# Altium project ESP_Radio.PrjPcb
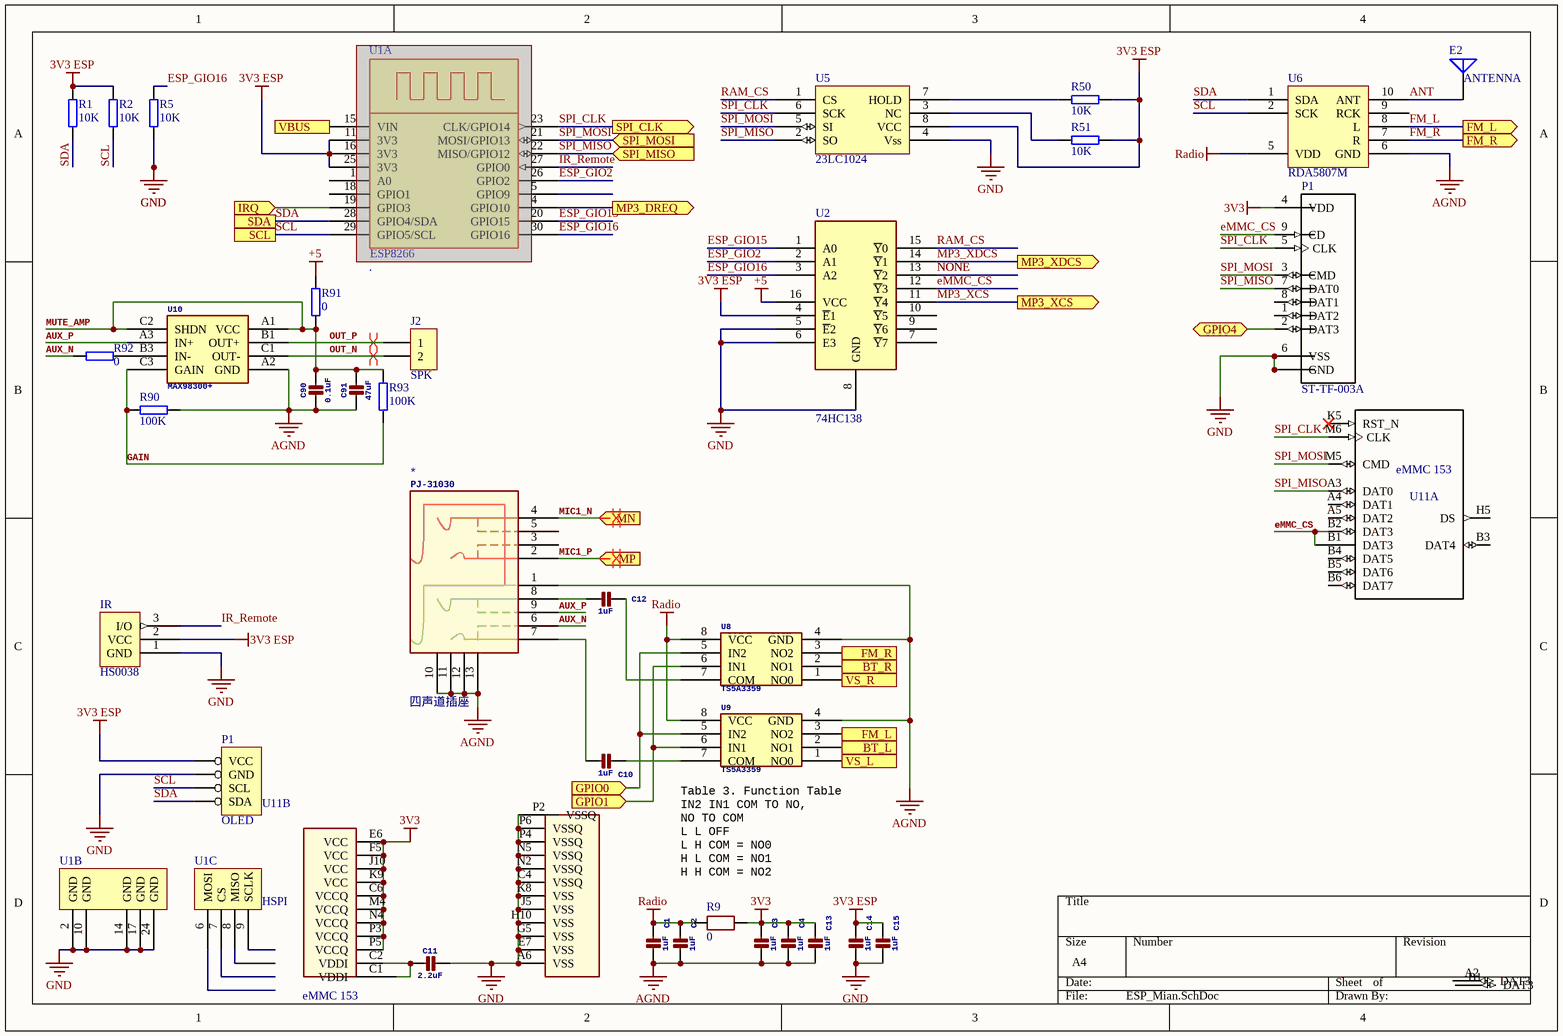
[diagram p0: ESP_Mian.SchDoc]
5 sheets, 201 parts. Net scope: flat (ports and power ports of the same name join across sheets).
Board file: Radio.PcbDoc
Sheets:
  ESP_Mian.SchDoc
  VS1053.SchDoc
  CSR8645.SchDoc
  PowerSys.SchDoc
  BQ24610.SchDoc

## Sheet ESP_Mian.SchDoc
size A4

### Parts
(Parts that share a designator on the sheet are numbered #1, #2 ... from top to bottom, then left to right.)
*  四声道插座  [pj-31030]
C1  1uF  [1206]
C2  1uF  [1206]
C3  1uF  [1206]
C4  1uF  [1206]
C10  1uF  [1206]
C11  2.2uF  [0603]
C12  1uF  [1206]
C13  1uF  [0603AC]
C14  1uF  [1206]
C15  1uF  [1206]
C90  0.1uF  [0201]
C91  47uF  [_0805MP]
E2  ANTENNA  [P125-B]
IR  HS0038  [SIP03]
J2  SPK  [SIP2_1]
P1#1  ST-TF-003A  [*SUNTECH_ST-TF-003A_ST-TF-003A(Primary)]
P1#2  OLED  [SIP4]
R1  10K  [0805]
R2  10K  [0805]
R5  10K  [0603]
R9  0  [0603AR]
R50  10K  [0603]
R51  10K  [0603]
R90  100K  [0201]
R91  0  [0603]
R92  0  [0402]
R93  100K  [0201]
U1  .  [NodeMCU DevKit v1.0 - Inside Labels]  (parts A,B,C of 3)
U2  74HC138  [TSSOP-16]
U5  23LC1024  [SO8NB]
U6  RDA5807M  [RDA5807M]
U8  TS5A3359  [DCU-8N]
U9  TS5A3359  [DCU-8N]
U10  MAX98300+  [WLP-9]
U11  eMMC 153  [BGA153N50P14X14_1300X1150X100N_EM08APGD3-BA000-2(Primary)]  (parts A,B of 2)

### Ports
BT_L (in), BT_R (in), FM_L (in), FM_L (out), FM_R (in), FM_R (out), GPIO0 (in), GPIO1 (in), GPIO4 (bidir), IRQ (in), MN (in), MP3_DREQ (out), MP3_XCS (out), MP3_XDCS (out), MP (in), SCL, SDA, SPI_CLK (out), SPI_MISO (in), SPI_MOSI (in), VBUS (out), VS_L (in), VS_R (in)

### Nets
3V3: C3.1 C4.1 C13.1 P1#1.4(VDD) R9.1 U11.C6(VCCQ) U11.E6(VCC) U11.F5(VCC) U11.J10(VCC) U11.K9(VCC) U11.M4(VCCQ) U11.N4(VCCQ) U11.P3(VCCQ) U11.P5(VCCQ)
3V3 ESP: C14.1 C15.1 IR.2(VCC) P1#2.3(VCC) R1.2 R2.2 R50.1 R51.1 U1.11(3V3) U1.16(3V3) U1.25(3V3) U2.4(~{E}1) U5.8(VCC)
+5: R91.2 U2.16(VCC)
AGND: *.1 *.10 *.11 *.12 *.13 C1.2 C2.2 C3.2 C4.2 C13.2 C90.2 C91.2 R90.2 U6.6(GND) U8.4(GND) U9.4(GND) U10.A2(GND)
GND: C11.1 C14.2 C15.2 IR.1(GND) P1#1.6(VSS) P1#1.G1(GND) P1#1.G2(GND) P1#1.G3(GND) P1#1.G4(GND) P1#2.4(GND) R5.1 U1.2(GND) U1.10(GND) U1.14(GND) U1.17(GND) U1.24(GND) U2.5(~{E}2) U2.6(E3) U2.8(GND) U5.4(Vss) U11.A6(VSS) U11.C4(VSSQ) U11.E7(VSS) U11.G5(VSS) U11.H10(VSS) U11.J5(VSS) U11.K8(VSS) U11.N2(VSSQ) U11.N5(VSSQ) U11.P2(VSSQ) U11.P4(VSSQ) U11.P6(VSSQ)
Radio: C1.1 C2.1 R9.2 U6.5(VDD) U8.8(VCC) U9.8(VCC)
ANT: E2.1(A) U6.10(ANT)
AUX_N: *.6 R92.2
AUX_P: *.9 U10.A3(IN+)
BT_L: U9.2(NO1) ; port BT_L
BT_R: U8.2(NO1) ; port BT_R
eMMC_CS: P1#1.9(CD) U2.12(~{Y}3) U11.B1(DAT3) U11.B2(DAT3)
ESP_GIO2: U1.26(GPIO2) U2.2(A1)
ESP_GIO15: U1.20(GPIO15) U2.1(A0)
ESP_GIO16: R5.2 U1.30(GPIO16) U2.3(A2)
FM_L: U6.8(L) U9.3(NO2) ; port FM_L
FM_R: U6.7(R) U8.3(NO2) ; port FM_R
GAIN: R90.1 R93.2 U10.C3(GAIN)
GPIO0: U8.5(IN2) U9.5(IN2) ; port GPIO0
GPIO1: U8.6(IN1) U9.6(IN1) ; port GPIO1
IR_Remote: IR.3(I/O) U1.27(GPIO0)
MIC1_N: *.4 ; port MN
MIC1_P: *.2 ; port MP
MP3_DREQ: U1.4(GPIO10) ; port MP3_DREQ
MP3_XCS: U2.11(~{Y}4) ; port MP3_XCS
MP3_XDCS: U2.14(~{Y}1) ; port MP3_XDCS
MUTE_AMP: C90.1 C91.1 R91.1 R93.1 U10.A1(VCC) U10.C2(SHDN)
NONE: U2.13(~{Y}2)
OUT_N: J2.1(2) U10.C1(OUT-)
OUT_P: J2.2(1) U10.B1(OUT+)
RAM_CS: U2.15(~{Y}0) U5.1(CS)
SCL: P1#2.2(SCL) R2.1 U1.29(GPIO5/SCL) U6.2(SCK) ; port SCL
SDA: P1#2.1(SDA) R1.1 U1.28(GPIO4/SDA) U6.1(SDA) ; port SDA
SPI_CLK: P1#1.5(CLK) U1.23(CLK/GPIO14) U5.6(SCK) U11.M6(CLK) ; port SPI_CLK
SPI_MISO: P1#1.7(DAT0) U1.22(MISO/GPIO12) U5.2(SO) U11.A3(DAT0) ; port SPI_MISO
SPI_MOSI: P1#1.3(CMD) U1.21(MOSI/GPIO13) U5.5(SI) U11.M5(CMD) ; port SPI_MOSI
VS_L: U9.1(NO0) ; port VS_L
VS_R: U8.1(NO0) ; port VS_R
Net*_7: *.7 C10.2
Net*_8: *.8 C12.2
NetC10_1: C10.1 U9.7(COM)
NetC11_2: C11.2 U11.C1(VDDI) U11.C2(VDDI)
NetC12_1: C12.1 U8.7(COM)
NetP1#1_2: P1#1.2(DAT3) ; port GPIO4
NetR50_2: R50.2 U5.7(HOLD)
NetR51_2: R51.2 U5.3(NC)
NetR92_1: R92.1 U10.B3(IN-)
NetU1_15: U1.15(VIN) ; port VBUS
NetU1_19: U1.19(GPIO3) ; port IRQ

Not connected (* = marked no-connect by the designer): * 3 5; P1#1 1(DAT2) 8(DAT1); U1 1(A0) 5(GPIO9) 6(MOSI) 7(CS) 8(MISO) 9(SCLK) 18(GPIO1); U2 7(~{Y}7) 9(~{Y}6) 10(~{Y}5); U6 9(RCK); U11 A2(DAT3) A4(DAT1) A5(DAT2) B3(DAT4) B4(DAT5) B5(DAT6) B6(DAT7) H5(DS) K5(RST_N)*

### Layout directives
differential pair; differential pair class Amplifier: OUT_P
differential pair: MIC1_N, MIC1_P, OUT_N

### Notes on the sheet
- (near U11) Table 3. Function Table
  IN2 IN1 COM TO NO,
  NO TO COM
  L L OFF
  L H COM = NO0
  H L COM = NO1
  H H COM = NO2
- (in symbol ESP8266_Devlop, part A) ESP8266
- (in symbol ESP8266_Devlop, part C) HSPI

### Library data of the parts
* = 四声道插座: PJ-31030
C1 C10-C12 C14 C90 C91 = CAP_CERAMIC_0805MP: Ceramic CapacitorsFor new designs, use the packages preceded by an '_' character since they are more reliable:The following footprints should be used on most boards:For extremely tight-pitch boards where space is at a premium, the following 'micro-pitch' footprints can be used (smaller pads, no silkscreen outline, etc.):; GateName_1: G$1; SymbolName_1: CAPACITOR; DeviceName: _0805MP; LibraryName: microbuilder; DeviceSetName: CAP_CERAMIC
C2-C4 C13 C15 = CAP: Ceramic CapacitorsFor new designs, use the packages preceded by an '_' character since they are more reliable:The following footprints should be used on most boards:For extremely tight-pitch boards where space is at a premium, the following 'micro-pitch' footprints can be used (smaller pads, no silkscreen outline, etc.):; GateName_1: G$1; DeviceName: 0603-NOOUTLINE; DeviceSetName: CAP_CERAMIC; SymbolName_1: CAPACITOR; LibraryName: microbuilder
E2 = ANTENNA: Generic Antenna
J2 = CON2: Connector
P1#1 = ST-TF-003A: Micro SD; MF: Suntech; Package: None; MP: ST-TF-003A; Price: None; Availability: Unavailable; SnapEDA_Link: https://www.snapeda.com/parts/ST-TF-003A/Suntech/view-part/?ref=snap; Value: *
P1#2 = 4 HEADER: 4 Pin Header
R1 R2 R5 R9 R50 R51 R90-R93 = RES2: Resistor
U1 = ESP8266_Devlop
U2 = 74HC138: 3-to-8 line decoder/demultiplexer; inverting
U10 = MAX98300+: Mono 2.6W ClassD Amp.
U11 = eMMC 153: eMMC BGA-153 1.5x13x1.0; MF: Delkin Devices; MP: EM08APGD3-BA000-2; Availability: Unavailable; Price: None; Package: None; SnapEDA_Link: https://www.snapeda.com/parts/EM08APGD3-BA000-2/Delkin%20Devices/view-part/?ref=snap; Value: *

## Sheet VS1053.SchDoc
size A3; Organization: Altium Limited; Address1: L3, 12a Rodborough Rd; Address2: Frenchs Forest; Address3: NSW; Address4: Australia 2086
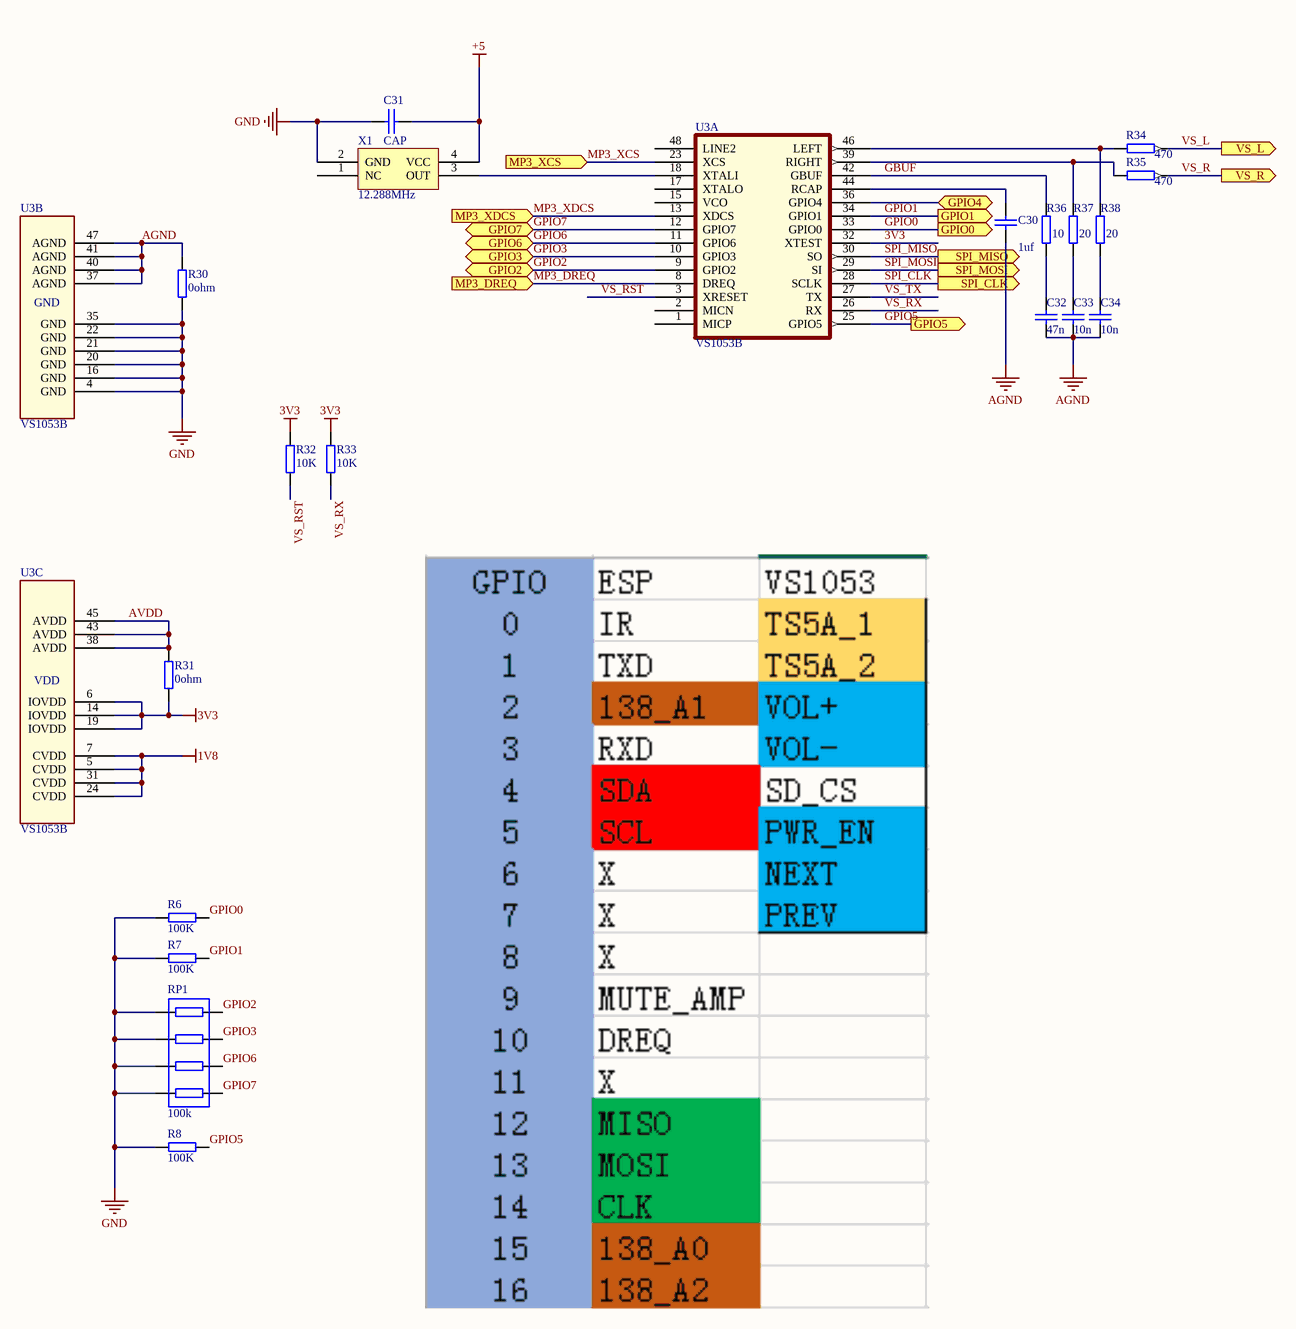
[diagram p1: VS1053.SchDoc]

### Parts
C30  value 1uf  [0402]  (hidden comment: Cap)
C31  CAP  [3528]
C32  value 47n  [0402]
C33  value 10n  [0402]  (hidden comment: Cap)
C34  value 10n  [0402]  (hidden comment: Cap)
R6  100K  [0603AR]
R7  100K  [0603AR]
R8  100K  [0603AR]
R30  0ohm  [0603AC]
R31  0ohm  [0603AC]
R32  10K  [0603AR]
R33  10K  [0603AR]
R34  470  [0603AR]
R35  470  [0603AR]
R36  10  [0603AC]
R37  20  [0603AC]
R38  20  [0603AC]
RP1  100k  [RN8]
U3  VS1053B  [LQFP-48]  (parts A,B,C of 3)
X1  12.288MHz  [DIL-14]

### Ports
GPIO0 (out), GPIO1 (out), GPIO2 (bidir), GPIO3 (bidir), GPIO4 (bidir), GPIO5 (out), GPIO6 (bidir), GPIO7 (bidir), MP3_DREQ (in), MP3_XCS (in), MP3_XDCS (in), SPI_CLK (out), SPI_MISO (out), SPI_MOSI (out), VS_L (out), VS_R (out)

### Nets
1V8: U3.5(CVDD) U3.7(CVDD) U3.24(CVDD) U3.31(CVDD)
3V3: R31.1 R32.2 R33.2 U3.6(IOVDD) U3.14(IOVDD) U3.19(IOVDD) U3.32(XTEST)
+5: C31.1 X1.4(VCC)
AGND: C30.1 C32.1 C33.1 C34.1 R30.2 U3.37(AGND) U3.40(AGND) U3.41(AGND) U3.47(AGND)
GND: C31.2 R6.1 R7.1 R8.1 R30.1 RP1.1 RP1.2 RP1.3 RP1.4 U3.4(GND) U3.16(GND) U3.20(GND) U3.21(GND) U3.22(GND) U3.35(GND) X1.2(GND)
AVDD: R31.2 U3.38(AVDD) U3.43(AVDD) U3.45(AVDD)
GBUF: R36.1 U3.42(GBUF)
GPIO0: R6.2 U3.33(GPIO0) ; port GPIO0
GPIO1: R7.2 U3.34(GPIO1) ; port GPIO1
GPIO2: RP1.8 U3.9(GPIO2) ; port GPIO2
GPIO3: RP1.7 U3.10(GPIO3) ; port GPIO3
GPIO5: R8.2 U3.25(GPIO5) ; port GPIO5
GPIO6: RP1.6 U3.11(GPIO6) ; port GPIO6
GPIO7: RP1.5 U3.12(GPIO7) ; port GPIO7
MP3_DREQ: U3.8(DREQ) ; port MP3_DREQ
MP3_XCS: U3.23(XCS) ; port MP3_XCS
MP3_XDCS: U3.13(XDCS) ; port MP3_XDCS
SPI_CLK: U3.28(SCLK) ; port SPI_CLK
SPI_MISO: U3.30(SO) ; port SPI_MISO
SPI_MOSI: U3.29(SI) ; port SPI_MOSI
VS_L: R34.2 ; port VS_L
VS_R: R35.2 ; port VS_R
VS_RST: R32.1 U3.3(XRESET)
VS_RX: R33.1 U3.26(RX)
VS_TX: U3.27(TX)
NetC30_2: C30.2 U3.44(RCAP)
NetC32_2: C32.2 R36.2
NetC33_2: C33.2 R37.2
NetC34_2: C34.2 R38.2
NetP1#1_2: U3.36(GPIO4) ; port GPIO4
NetR34_1: R34.1 R38.1 U3.46(LEFT)
NetR35_1: R35.1 R37.1 U3.39(RIGHT)
NetU3_18: U3.18(XTALI) X1.3(OUT)

Not connected (* = marked no-connect by the designer): U3 1(MICP) 2(MICN) 15(VCO) 17(XTALO) 48(LINE2); X1 1(NC)

### Notes on the sheet
- Title
- Size:
- Date:
- A3
- Number:
- Time:
- Revision:
- Sheet
- of
- File:
- (in symbol VS1053B, part C) VDD

### Library data of the parts
C30 C32-C34 = Cap: 贴片电容; Published: 8-Jun-2000; LatestRevisionDate: 17-Jul-2002; LatestRevisionNote: Re-released for DXP Platform.; PackageReference: RAD-0.3; Publisher: Altium Limited
C31 = CAP: Capacitor
R6-R8 R30-R38 = RES2: Resistor
RP1 = RESPACK4A: Resistor Network
X1 = OSC: 有源晶振

## Sheet CSR8645.SchDoc
size A3; Organization: Altium Limited; Address1: L3, 12a Rodborough Rd; Address2: Frenchs Forest; Address3: NSW; Address4: Australia 2086
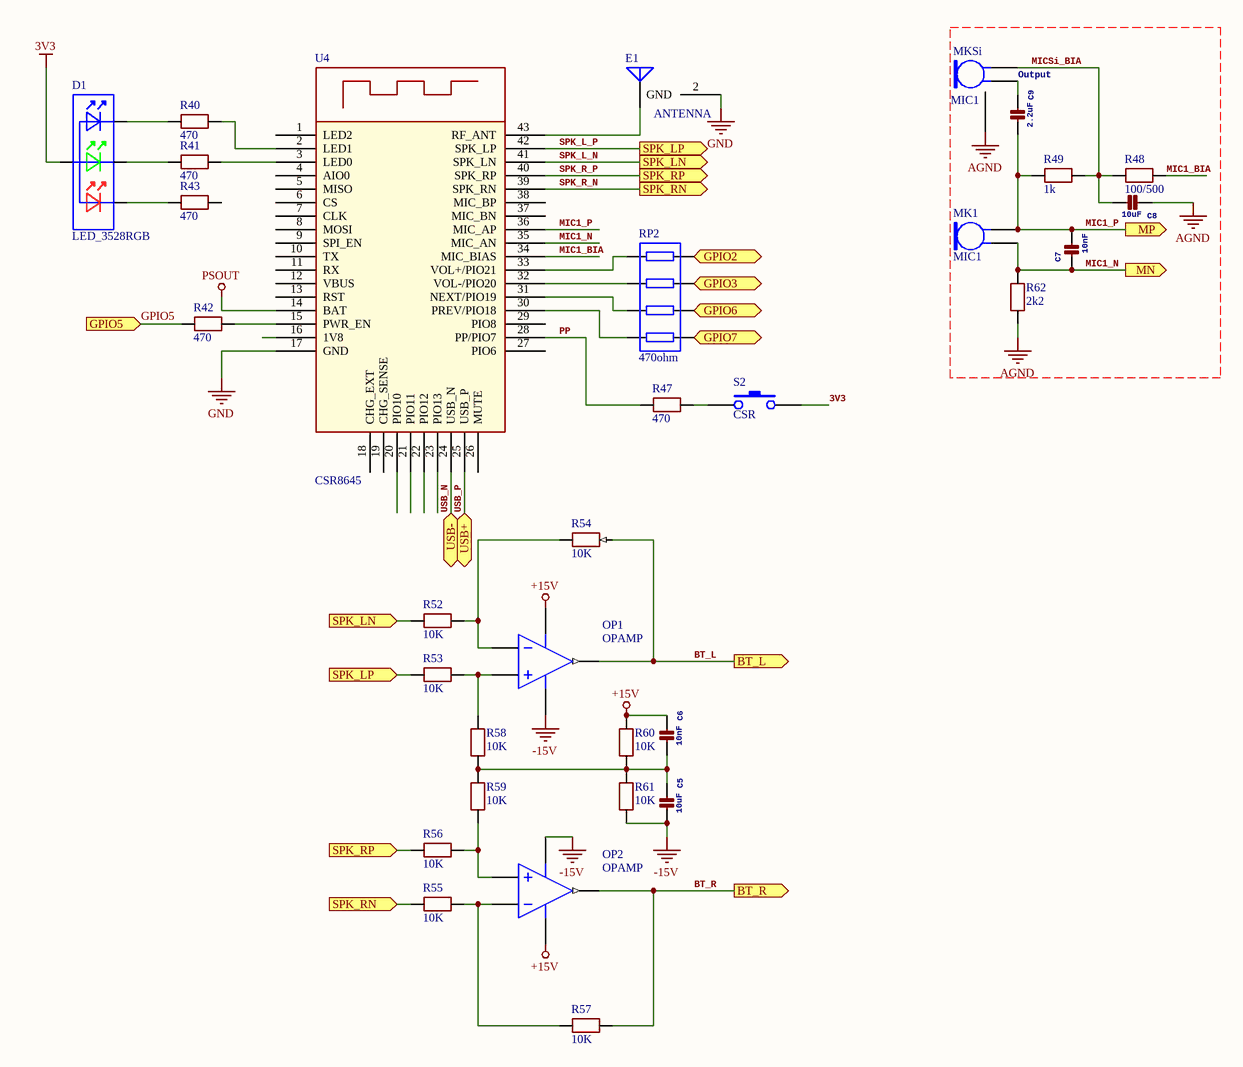
[diagram p2: CSR8645.SchDoc]

### Parts
C5  10uF  [RB3/7MM]
C6  10nF  [WIMA-MKS2C031001A00]
C7  10nF  [0201]
C8  10uF  [0201]
C9  2.2uF  [0201]
D1  LED_3528RGB  [1204_RGB]
E1  ANTENNA  [SMA_FR]
MK1  MIC1  [LED-F3]
MKSi  MIC1  [ADMP504]
OP1  OPAMP  [DIP-8]
OP2  OPAMP  [DIP-8]
R40  470  [0603AR]
R41  470  [0603AR]
R42  470  [0603AR]
R43  470  [0603AR]
R47  470  [0603AR]
R48  100/500  [0402]
R49  1k  [0402]
R52  10K  [MELF-R3216-1206]
R53  10K  [MELF-R3216-1206]
R54  10K  [MELF-R3216-1206]
R55  10K  [MELF-R3216-1206]
R56  10K  [MELF-R3216-1206]
R57  10K  [MELF-R3216-1206]
R58  10K  [MELF-R3216-1206]
R59  10K  [MELF-R3216-1206]
R60  10K  [MELF-R3216-1206]
R61  10K  [MELF-R3216-1206]
R62  2k2  [0402]
RP2  470ohm  [RN8]
S2  CSR  [sw_side]
U4  CSR8645  [CSR8645]

### Ports
BT_L (out), BT_R (out), GPIO2 (bidir), GPIO3 (bidir), GPIO5 (in), GPIO6 (bidir), GPIO7 (bidir), MN (out), MP (out), SPK_LN (in), SPK_LN (out), SPK_LP (in), SPK_LP (out), SPK_RN (in), SPK_RN (out), SPK_RP (in), SPK_RP (out), USB+ (bidir), USB- (bidir)

### Nets
3V3: D1.1(+) S2.1
+15V: C6.1 OP1.7(V+) OP2.7(V+) R60.1
-15V: C5.2 OP1.4(V-) OP2.4(V-) R61.2
AGND: C8.1 MKSi.2(GND) R62.2
GND: E1.2(GND) U4.17(GND)
PSOUT: U4.14(BAT)
BT_L: OP1.6(OUT) R54.1 ; port BT_L
BT_R: OP2.6(OUT) R57.1 ; port BT_R
GPIO2: RP2.8 ; port GPIO2
GPIO3: RP2.7 ; port GPIO3
GPIO5: R42.2 ; port GPIO5
GPIO6: RP2.6 ; port GPIO6
GPIO7: RP2.5 ; port GPIO7
MIC1_BIA: R48.2 U4.34(MIC_BIAS)
MIC1_N: C7.2 MK1.1 R62.1 U4.35(MIC_AN) ; port MN
MIC1_P: C7.1 C9.2 MK1.2 R49.2 U4.36(MIC_AP) ; port MP
MICSi_BIA: C8.2 MKSi.3(VDD) R48.1 R49.1
PP: R47.2 U4.28(PP/PIO7)
SPK_L_N: R52.2 U4.41(SPK_LN) ; port SPK_LN
SPK_L_P: R53.2 U4.42(SPK_LP) ; port SPK_LP
SPK_R_N: R55.2 U4.39(SPK_RN) ; port SPK_RN
SPK_R_P: R56.2 U4.40(SPK_RP) ; port SPK_RP
USB_N: U4.24(USB_N) ; port USB-
USB_P: U4.25(USB_P) ; port USB+
NetC5_1: C5.1 C6.2 R58.2 R59.1 R60.2 R61.1
NetC9_1: C9.1 MKSi.1(OUTPUT)
NetD1_2: D1.2(R-) R43.2
NetD1_3: D1.3(G-) R41.2
NetD1_4: D1.4(B-) R40.2
NetE1_1: E1.1(A) U4.43(RF_ANT)
NetOP1_2: OP1.2(IN-) R52.1 R54.2
NetOP1_3: OP1.3(IN+) R53.1 R58.1
NetOP2_2: OP2.2(IN-) R55.1 R57.2
NetOP2_3: OP2.3(IN+) R56.1 R59.2
NetR40_1: R40.1 U4.2(LED1)
NetR41_1: R41.1 U4.3(LED0)
NetR42_1: R42.1 U4.15(PWR_EN)
NetR47_1: R47.1 S2.2
NetRP2_1: RP2.1 U4.33(VOL+/PIO21)
NetRP2_2: RP2.2 U4.32(VOL-/PIO20)
NetRP2_3: RP2.3 U4.31(NEXT/PIO19)
NetRP2_4: RP2.4 U4.30(PREV/PIO18)

Not connected (* = marked no-connect by the designer): R43 1; U4 1(LED2) 4(AIO0) 5(MISO) 6(CS) 7(CLK) 8(MOSI) 9(SPI_EN) 10(TX) 11(RX) 12(VBUS) 13(RST) 16(1V8) 18(CHG_EXT) 19(CHG_SENSE) 20(PIO10) 21(PIO11) 22(PIO12) 23(PIO13) 26(MUTE) 27(PIO6) 29(PIO8) 37(MIC_BN) 38(MIC_BP)

### Notes on the sheet
- Output
- Title
- Size:
- Date:
- A3
- Number:
- Time:
- Revision:
- Sheet
- of
- File:

### Library data of the parts
C5-C9 = CAP: as C2 on sheet ESP_Mian; SymbolName_1: CAPACITOR; LibraryName: microbuilder
D1 = LED_3528RGB: LED-3528RGB
E1 = ANTENNA: Generic Antenna
MK1 MKSi = MICROPHONE2: Microphone
OP1 OP2 = OPAMP: Operational Amplifier
R40-R43 R47-R49 R52-R62 = RES2: Resistor
RP2 = RESPACK4A: Resistor Network
S2 = SW-PB
U4 = CSR8645: Bluetooth Audio

## Sheet PowerSys.SchDoc
size A3; Organization: Altium Limited; Address1: L3, 12a Rodborough Rd; Address2: Frenchs Forest; Address3: NSW; Address4: Australia 2086
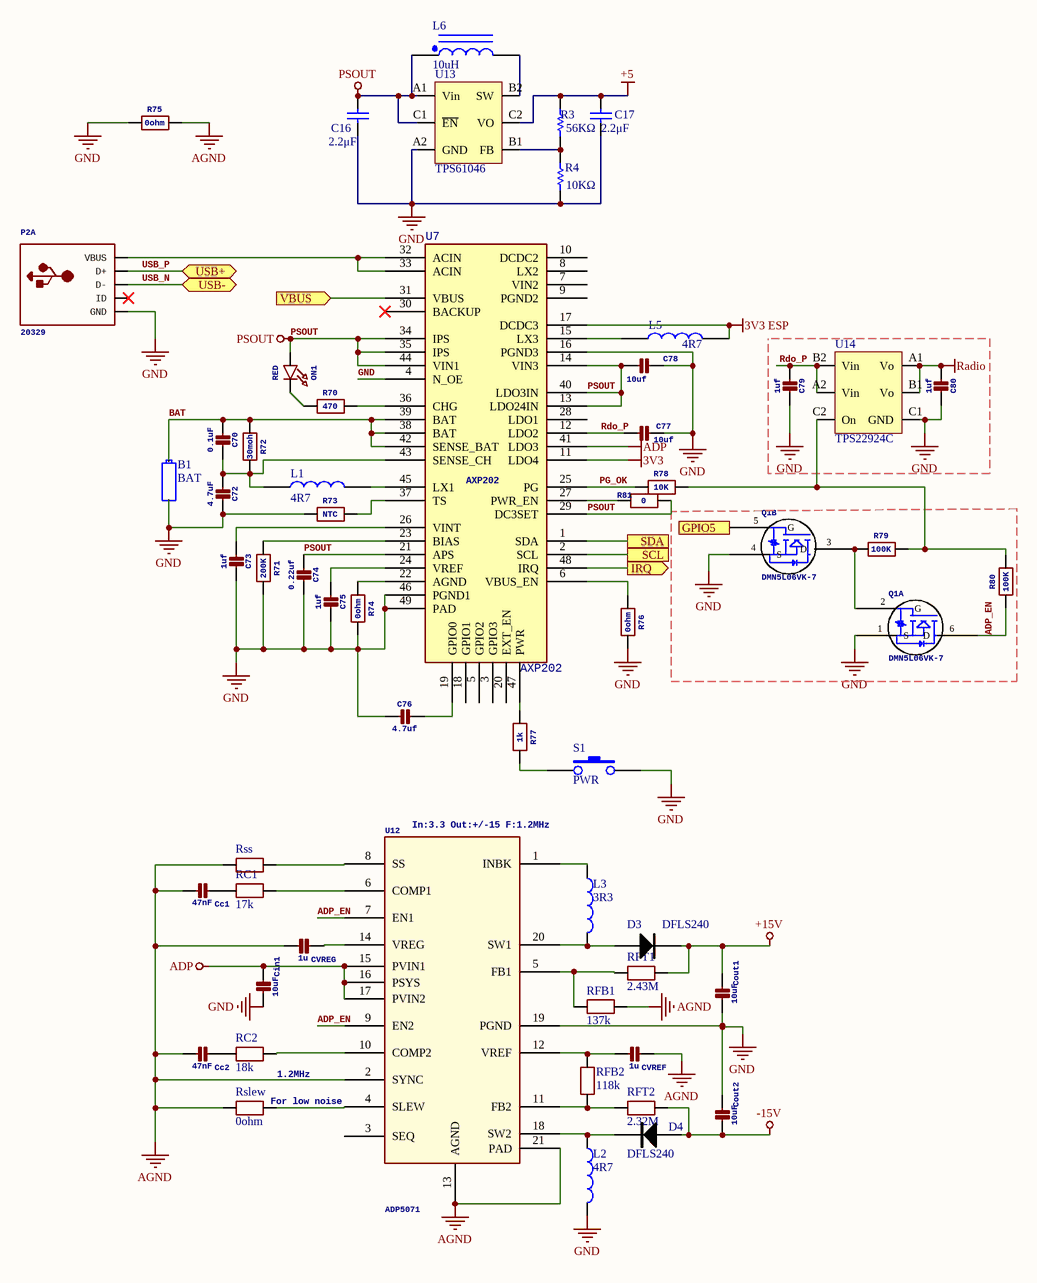
[diagram p3: PowerSys.SchDoc]

### Parts
B1  BAT  [TJC3-2A]
C16  value 2.2μF  [0603 cap]  (hidden comment: 2.2u)
C17  value 2.2μF  [0603 cap]  (hidden comment: 2.2u)
C70  0.1uF  [0603C-GENERIC]
C72  4.7uF  [0603C-GENERIC]
C73  1uf  [0603C-GENERIC]
C74  0.22uf  [0603C-GENERIC]
C75  1uf  [0603C-GENERIC]
C76  4.7uf  [0603C-GENERIC]
C77  10uf  [_0805MP]
C78  10uf  [_0805MP]
C79  1uf  [0201]
C80  1uf  [0201]
Cc1  47nF  [0201]
Cc2  47nF  [0201]
Cin1  10uF  [0805C]
Cout1  10uF  [0805C]
Cout2  10uF  [0805C]
CVREF  1u  [0603AC]
CVREG  1u  [0603AC]
D3  DFLS240  [SOD-123]
D4  DFLS240  [SOD-123]
L1  4R7  [SLF6028]
L2  4R7  [IHLP2525]
L3  3R3  [IHLP2525]
L5  4R7  [SLF6028]
L6  value 10uH  [LPS5030]  (hidden comment: 6R8)
ON1  RED  [CHIPLED_0805_NOOUTLINE]
P2  20329  [USB MICRO]  (part A of 2)
Q1  DMN5L06VK-7  [sot-563]  (parts A,B of 2)
R3  value 56KΩ  [0201]  (hidden comment: 56K)
R4  value 10KΩ  [0201]  (hidden comment: 10K)
R70  470  [0603R-10K]
R71  200K  [0603R-10K]
R72  30moh  [0603R-10K]
R73  NTC  [0603R-10K]
R74  0ohm  [0201]
R75  0ohm  [0402]
R76  0ohm  [0201]
R77  1k  [0603R-10K]
R78  10K  [0603R-10K]
R79  100K  [0201]
R80  100K  [0201]
R81  0  [0603R-10K]
RC1  17k  [0402]
RC2  18k  [0402]
RFB1  137k  [0402]
RFB2  118k  [0402]
RFT1  2.43M  [0402]
RFT2  2.32M  [0402]
Rslew  0ohm  [0201]
Rss  (no value)  [0402]
S1  PWR  [sw_side]
U7  AXP202  [QFN-48-6MM]
U12  ADP5071  [LFCSP-20]
U13  TPS61046  [WCSP-6-DSBGA-6]
U14  TPS22924C  [WCSP-6-DSBGA-6]

### Ports
GPIO5 (in), IRQ (out), SCL, SDA, USB+ (bidir), USB- (bidir), VBUS (in)

### Nets
3V3: U7.11(LDO4)
3V3 ESP: L5.2 U7.17(DCDC3)
+5: C17.2 R3.2 U13.C2(VO)
+15V: Cout1.1 D3.2(K) RFT1.2
-15V: Cout2.2 D4.1(A) RFT2.2
ADP: Cin1.1 U7.41(LDO3) U12.15(PVIN1) U12.16(PSYS) U12.17(PVIN2)
AGND: Cc1.2 Cc2.2 CVREF.1 CVREG.2 R75.2 RFB1.1 Rslew.2 Rss.2 U12.2(SYNC) U12.13(AGND) U12.21(PAD)
GND: B1.2 C16.1 C17.1 C72.1 C73.1 C74.1 C75.1 C76.2 C77.1 C78.1 C79.1 C80.1 Cin1.2 Cout1.2 Cout2.1 L2.2 P2.5(GND) Q1.1(S) Q1.4(S) R4.1 R71.2 R73.1 R74.2 R75.1 R76.2 S1.1 U7.4(N_OE) U7.16(PGND3) U7.46(PGND1) U7.49(PAD) U12.19(PGND) U13.A2(GND) U14.C1(GND)
PSOUT: C16.2 C74.2 C78.2 L6.1 ON1.A R81.2 U7.13(LDO24IN) U7.14(VIN3) U7.21(APS) U7.29(DC3SET) U7.34(IPS) U7.35(IPS) U7.40(LDO3IN) U7.44(VIN1) U13.A1(Vin) U13.C1(~{EN})
Radio: C80.2 U14.A1(Vo) U14.B1(Vo)
ADP_EN: Q1.6(D) R80.1 U12.7(EN1) U12.9(EN2)
BAT: B1.1 C70.2 R72.1 U7.38(BAT) U7.39(BAT) U7.42(SENSE_BAT)
GPIO5: Q1.5(G) ; port GPIO5
PG_OK: R78.1 U7.25(PG)
Rdo_P: C77.2 C79.2 U7.12(LDO2) U14.A2(Vin) U14.B2(Vin)
SCL: U7.2(SCL) ; port SCL
SDA: U7.1(SDA) ; port SDA
USB_N: P2.2(D-) ; port USB-
USB_P: P2.3(D+) ; port USB+
NetC70_1: C70.1 C72.2 L1.1 R72.2 U7.43(SENSE_CH)
NetC73_2: C73.2 U7.26(VINT)
NetC75_2: C75.2 U7.24(VREF)
NetC76_1: C76.1 U7.19(GPIO0)
NetCc1_1: Cc1.1 RC1.2
NetCc2_1: Cc2.1 RC2.2
NetCVREF_2: CVREF.2 RFB2.1 U12.12(VREF)
NetCVREG_1: CVREG.1 U12.14(VREG)
NetD3_1: D3.1(A) L3.2 U12.20(SW1)
NetD4_2: D4.2(K) L2.1 U12.18(SW2)
NetL1_2: L1.2 U7.45(LX1)
NetL3_1: L3.1 U12.1(INBK)
NetL5_1: L5.1 U7.15(LX3)
NetL6_2: L6.2 U13.B2(SW)
NetON1_C: ON1.C R70.1
NetP2_1: P2.1(VBUS) U7.32(ACIN) U7.33(ACIN)
NetQ1_2: Q1.2(G) Q1.3(D) R79.1
NetR3_1: R3.1 R4.2 U13.B1(FB)
NetR70_2: R70.2 U7.36(CHG)
NetR71_1: R71.1 U7.23(BIAS)
NetR73_2: R73.2 U7.37(TS)
NetR74_1: R74.1 U7.22(AGND)
NetR76_1: R76.1 U7.6(VBUS_EN)
NetR77_1: R77.1 U7.47(PWR)
NetR77_2: R77.2 S1.2
NetR78_2: R78.2 R79.2 R80.2 U14.C2(On)
NetR81_1: R81.1 U7.27(PWR_EN)
NetRC1_1: RC1.1 U12.6(COMP1)
NetRC2_1: RC2.1 U12.10(COMP2)
NetRFB1_2: RFB1.2 RFT1.1 U12.5(FB1)
NetRFB2_2: RFB2.2 RFT2.1 U12.11(FB2)
NetRslew_1: Rslew.1 U12.4(SLEW)
NetRss_1: Rss.1 U12.8(SS)
NetU1_15: U7.31(VBUS) ; port VBUS
NetU1_19: U7.48(IRQ) ; port IRQ

Not connected (* = marked no-connect by the designer): P2 4(ID)*; U7 3(GPIO3) 5(GPIO2) 7(VIN2) 8(LX2) 9(PGND2) 10(DCDC2) 18(GPIO1) 20(EXT_EN) 28(LDO1) 30(BACKUP)*; U12 3(SEQ)

### Notes on the sheet
- (near U12) In:3.3 Out:+/-15 F:1.2MHz
- 1.2MHz
- (near Rslew) For low noise
- Title
- Size:
- Date:
- A3
- Number:
- Time:
- Revision:
- Sheet
- of
- File:

### Library data of the parts
C16 C17 = Cap0805: Capacitor; Published: 8-Jun-2000; LatestRevisionDate: 17-Jul-2002; LatestRevisionNote: Re-released for DXP Platform.; PackageReference: RAD-0.3; Publisher: Altium Limited; PackageDescription: Radial Cap, Thru-Hole; 2 Leads; 0.3 in Pin Spacing
C70 C72-C80 = CAP_CERAMIC_0805MP: as C1 on sheet ESP_Mian; SymbolName_1: CAPACITOR; DeviceName: _0805MP; LibraryName: microbuilder; DeviceSetName: CAP_CERAMIC
Cc1 Cc2 Cin1 Cout1 Cout2 CVREF CVREG = CAP: as C2 on sheet ESP_Mian; SymbolName_1: CAPACITOR; LibraryName: microbuilder
D3 D4 = MBRS140: DIODE; Supplier 1: Digi-Key; Supplier Part Number 1: MBRS140FSTR-ND
L1 L5 = INDUCTOR1
L2 L3 = INDUCTOR
L6 = Inductor Iron Dot: Magnetic-Core Inductor with Winding Polarity Marking; Published: 24-Mar-1999; LatestRevisionDate: 17-Jul-2002; LatestRevisionNote: Re-released for DXP Platform.; PackageReference: DIODE_SMC; Publisher: Altium Limited; PackageDescription: Diode; 2 Leads
ON1 = LED0805_NOOUTLINE: LED0603 - 0603 Surface Mount Package 2mA:5mA:0805 - 0805 Surface Mount Package 2mA:20mA:; GateName_1: G$1; SymbolName_1: LED; DeviceName: 0805_NOOUTLINE; LibraryName: microbuilder; DeviceSetName: LED
P2 = USB_W_SHIELD_20329: GateName_1: CONN; SymbolName_1: USB; GateName_2: SHIELD; SymbolName_2: PINHD1; DeviceName: _20329; LibraryName: microbuilder; DeviceSetName: USB_W_SHIELD
Q1 = DMN5L06VK-7: DUAL N-CHANNEL ENHANCEMENT MODE MOSFET SOT-563
R3 R4 = RES: Resistor; Published: 8-Jun-2000; LatestRevisionDate: 17-Jul-2002; LatestRevisionNote: Re-released for DXP Platform.; PackageReference: AXIAL-0.3; Publisher: Altium Limited; PackageDescription: Axial Device, Thru-Hole; 2 Leads; 0.3 in Pin Spacing
R70-R81 = RESISTOR0805_NOOUTLINE: ResistorsFor new designs, use the packages preceded by an '_' character since they are more reliable:The following footprints should be used on most boards:For extremely tight-pitch boards where space is at a premium, the following 'micro-pitch' footprints can be used (smaller pads, no silkscreen outline, etc.):; GateName_1: G$1; SymbolName_1: RESISTOR; DeviceName: 0805_NOOUTLINE; LibraryName: microbuilder; DeviceSetName: RESISTOR
RC1 RC2 RFB1 RFB2 RFT1 RFT2 = RES2: Resistor
Rslew = RES2
Rss = RES2: 4 ms (268 kΩ) and 32 ms (50 kΩ)
S1 = SW-PB
U7 = AXP202: Power system management PWM Charge
U12 = ADP5071: 2 A/1.2 A DC-to-DC Switching Regulator with / Independent Positive and Negative Outputs
U13 = TPS61046: 5V Boost
U14 = TPS22924C: 3.6-V, 2-A, 18.3-mΩ On-Resistance Load Switch

## Sheet BQ24610.SchDoc
size A3; Organization: Altium Limited; Address1: L3, 12a Rodborough Rd; Address2: Frenchs Forest; Address3: NSW; Address4: Australia 2086
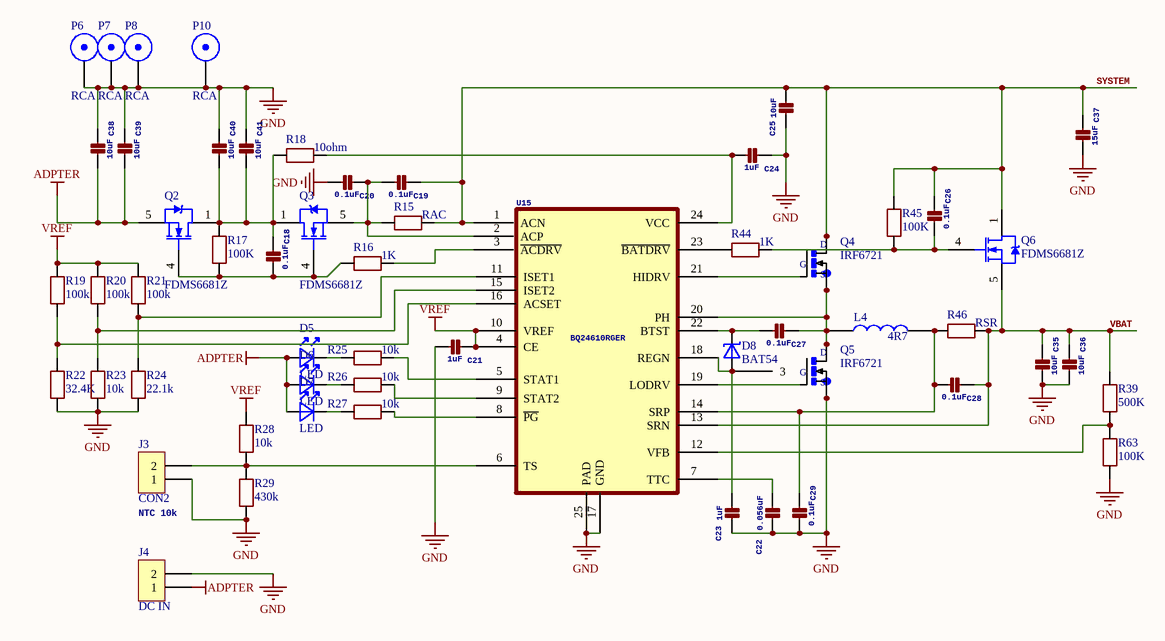
[diagram p4: BQ24610.SchDoc]

### Parts
C18  0.1uF  [0603AC]
C19  0.1uF  [0603AC]
C20  0.1uF  [0603AC]
C21  1uF  [0603AC]
C22  0.056uF  [0603AC]
C23  1uF  [0603AC]
C24  1uF  [0603AC]
C25  10uF  [0603AC]
C26  0.1uF  [0603AC]
C27  0.1uF  [0603AC]
C28  0.1uF  [0603AC]
C29  0.1uF  [0603AC]
C35  10uF  [1210]
C36  10uF  [1210]
C37  15uF  [2220]
C38  10uF  [1206]
C39  10uF  [1206]
C40  10uF  [1206]
C41  10uF  [1206]
D5  LED  [LED-0805]
D6  LED  [LED-0805]
D7  LED  [LED-0805]
D8  BAT54  [sot-23]
J3  CON2  [SIP02]
J4  DC IN  [DCIN]
L4  4R7  [IHLP5050]
P6  RCA  [定位孔 Φ3 1]
P7  RCA  [定位孔 Φ3 1]
P8  RCA  [定位孔 Φ3 1]
P10  RCA  [定位孔 Φ3 1]
Q2  FDMS6681Z  [SON8]
Q3  FDMS6681Z  [SON8]
Q4  IRF6721  [DIRECTFET_IRF6721Primary)]
Q5  IRF6721  [DIRECTFET_IRF6721Primary)]
Q6  FDMS6681Z  [SON8]
R15  RAC  [2010]
R16  1K  [0603AR]
R17  100K  [0603AR]
R18  10ohm  [0603AR]
R19  100k  [0603AR]
R20  100k  [0603AR]
R21  100k  [0603AR]
R22  32.4K  [0603AR]
R23  10k  [0603AR]
R24  22.1k  [0603AR]
R25  10k  [0603AR]
R26  10k  [0603AR]
R27  10k  [0603AR]
R28  10k  [0603AR]
R29  430k  [0603AR]
R39  500K  [0603AR]
R44  1K  [0603AR]
R45  100K  [0603AR]
R46  RSR  [2010]
R63  100K  [0603AR]
U15  BQ24610RGER  [QFN-24]

### Nets
ADPTER: C38.2 C39.2 D5.1 D6.1 D7.1 J4.1 Q2.5(S)
GND: C20.2 C21.2 C22.1 C23.1 C24.1 C25.1 C29.2 C35.2 C36.2 C37.2 C38.1 C39.1 C40.1 C41.1 J3.1 J4.2 P6.1(X) P7.1(X) P8.1(X) P10.1(X) Q5.S R22.2 R23.2 R24.2 R29.1 R63.2 U15.17(GND) U15.25(PAD)
VREF: C21.1 R19.1 R20.1 R21.1 R28.2 U15.4(CE) U15.10(VREF)
SYSTEM: C19.1 C25.2 C26.1 C37.1 Q4.D Q6.1(D) R15.1 R45.1 U15.1(ACN)
VBAT: C28.1 C35.1 C36.1 Q6.5(S) R39.1 R46.1 U15.13(SRN)
NetC18_1: C18.1 C40.2 C41.2 Q2.1(D) Q3.1(D) R17.1 R18.2
NetC18_2: C18.2 Q2.4(G) Q3.4(G) R16.2 R17.2
NetC19_2: C19.2 C20.1 Q3.5(S) R15.2 U15.2(ACP)
NetC22_2: C22.2 U15.7(TTC)
NetC23_2: C23.2 D8.1 D8.2(3) U15.18(REGN)
NetC24_2: C24.2 R18.1 U15.24(VCC)
NetC26_2: C26.2 Q6.4(G) R44.1 R45.2
NetC27_1: C27.1 L4.1 Q4.S Q5.D U15.20(PH)
NetC27_2: C27.2 D8.3 U15.22(BTST)
NetC28_2: C28.2 C29.1 L4.2 R46.2 U15.14(SRP)
NetD5_2: D5.2 R25.1
NetD6_2: D6.2 R26.1
NetD7_2: D7.2 R27.1
NetJ3_2: J3.2 R28.1 R29.2 U15.6(TS)
NetQ4_G: Q4.G U15.21(HIDRV)
NetQ5_G: Q5.G U15.19(LODRV)
NetR16_1: R16.1 U15.3(~{ACDRV})
NetR19_2: R19.2 R22.1 U15.16(ACSET)
NetR20_2: R20.2 R23.1 U15.15(ISET2)
NetR21_2: R21.2 R24.1 U15.11(ISET1)
NetR25_2: R25.2 U15.5(STAT1)
NetR26_2: R26.2 U15.9(STAT2)
NetR27_2: R27.2 U15.8(~{PG})
NetR39_2: R39.2 R63.1 U15.12(VFB)
NetR44_2: R44.2 U15.23(~{BATDRV})

### Notes on the sheet
- (near J3) NTC 10k
- Title
- Size:
- Date:
- A3
- Number:
- Time:
- Revision:
- Sheet
- of
- File:

### Library data of the parts
C18-C29 C35-C41 = CAP: as C2 on sheet ESP_Mian; SymbolName_1: CAPACITOR; LibraryName: microbuilder
D5-D7 = LED: 0805 LED
D8 = DIODE SCHOTTKY_1
J3 J4 = CON2: Therm
L4 = INDUCTOR1
P6-P8 P10 = RCA: RCA Connector
Q2 Q3 Q6 = N-Mosfet
Q4 Q5 = IRF6648: Mosfet n-Ch 60v 86a Directfet  -  Irf6648; MF: Infineon; Package: None; MP: IRF6648; SnapEDA_Link: https://www.snapeda.com/parts/IRF6648/Infineon%20Technologies/view-part/?ref=snap; Availability: Unavailable; Price: None; Value: *
R15 R46 = RES2: 0.01OHM
R16-R29 R39 R44 R45 R63 = RES2
U15 = BQ24610RGER: Stand-Alone Synchronous Switched-Mode Li-Ion or Li-Polymer Battery Charger / With System Power Selector and Low Iq

## Nets that join several sheets
3V3: ESP_Mian (14 pins), VS1053 (7 pins), CSR8645 (D1.1 S2.1), PowerSys (U7.11)
3V3 ESP: ESP_Mian (13 pins), PowerSys (L5.2 U7.17)
+5: ESP_Mian (R91.2 U2.16), VS1053 (C31.1 X1.4), PowerSys (C17.2 R3.2 U13.C2)
+15V: CSR8645 (C6.1 OP1.7 OP2.7 R60.1), PowerSys (Cout1.1 D3.2 RFT1.2)
-15V: CSR8645 (C5.2 OP1.4 OP2.4 R61.2), PowerSys (Cout2.2 D4.1 RFT2.2)
AGND: ESP_Mian (17 pins), VS1053 (9 pins), CSR8645 (C8.1 MKSi.2 R62.2), PowerSys (11 pins)
GND: ESP_Mian (32 pins), VS1053 (16 pins), CSR8645 (E1.2 U4.17), PowerSys (33 pins), BQ24610 (28 pins)
PSOUT: CSR8645 (U4.14), PowerSys (16 pins)
Radio: ESP_Mian (6 pins), PowerSys (C80.2 U14.A1 U14.B1)
BT_L: ESP_Mian (U9.2), CSR8645 (OP1.6 R54.1)
BT_R: ESP_Mian (U8.2), CSR8645 (OP2.6 R57.1)
GPIO0: ESP_Mian (U8.5 U9.5), VS1053 (R6.2 U3.33)
GPIO1: ESP_Mian (U8.6 U9.6), VS1053 (R7.2 U3.34)
GPIO2: VS1053 (RP1.8 U3.9), CSR8645 (RP2.8)
GPIO3: VS1053 (RP1.7 U3.10), CSR8645 (RP2.7)
GPIO5: VS1053 (R8.2 U3.25), CSR8645 (R42.2), PowerSys (Q1.5)
GPIO6: VS1053 (RP1.6 U3.11), CSR8645 (RP2.6)
GPIO7: VS1053 (RP1.5 U3.12), CSR8645 (RP2.5)
MIC1_N: ESP_Mian (*.4), CSR8645 (C7.2 MK1.1 R62.1 U4.35)
MIC1_P: ESP_Mian (*.2), CSR8645 (5 pins)
MP3_DREQ: ESP_Mian (U1.4), VS1053 (U3.8)
MP3_XCS: ESP_Mian (U2.11), VS1053 (U3.23)
MP3_XDCS: ESP_Mian (U2.14), VS1053 (U3.13)
NetP1#1_2: ESP_Mian (P1#1.2), VS1053 (U3.36)
NetU1_15: ESP_Mian (U1.15), PowerSys (U7.31)
NetU1_19: ESP_Mian (U1.19), PowerSys (U7.48)
SCL: ESP_Mian (P1#2.2 R2.1 U1.29 U6.2), PowerSys (U7.2)
SDA: ESP_Mian (P1#2.1 R1.1 U1.28 U6.1), PowerSys (U7.1)
SPI_CLK: ESP_Mian (P1#1.5 U1.23 U5.6 U11.M6), VS1053 (U3.28)
SPI_MISO: ESP_Mian (P1#1.7 U1.22 U5.2 U11.A3), VS1053 (U3.30)
SPI_MOSI: ESP_Mian (P1#1.3 U1.21 U5.5 U11.M5), VS1053 (U3.29)
USB_N: CSR8645 (U4.24), PowerSys (P2.2)
USB_P: CSR8645 (U4.25), PowerSys (P2.3)
VS_L: ESP_Mian (U9.1), VS1053 (R34.2)
VS_R: ESP_Mian (U8.1), VS1053 (R35.2)